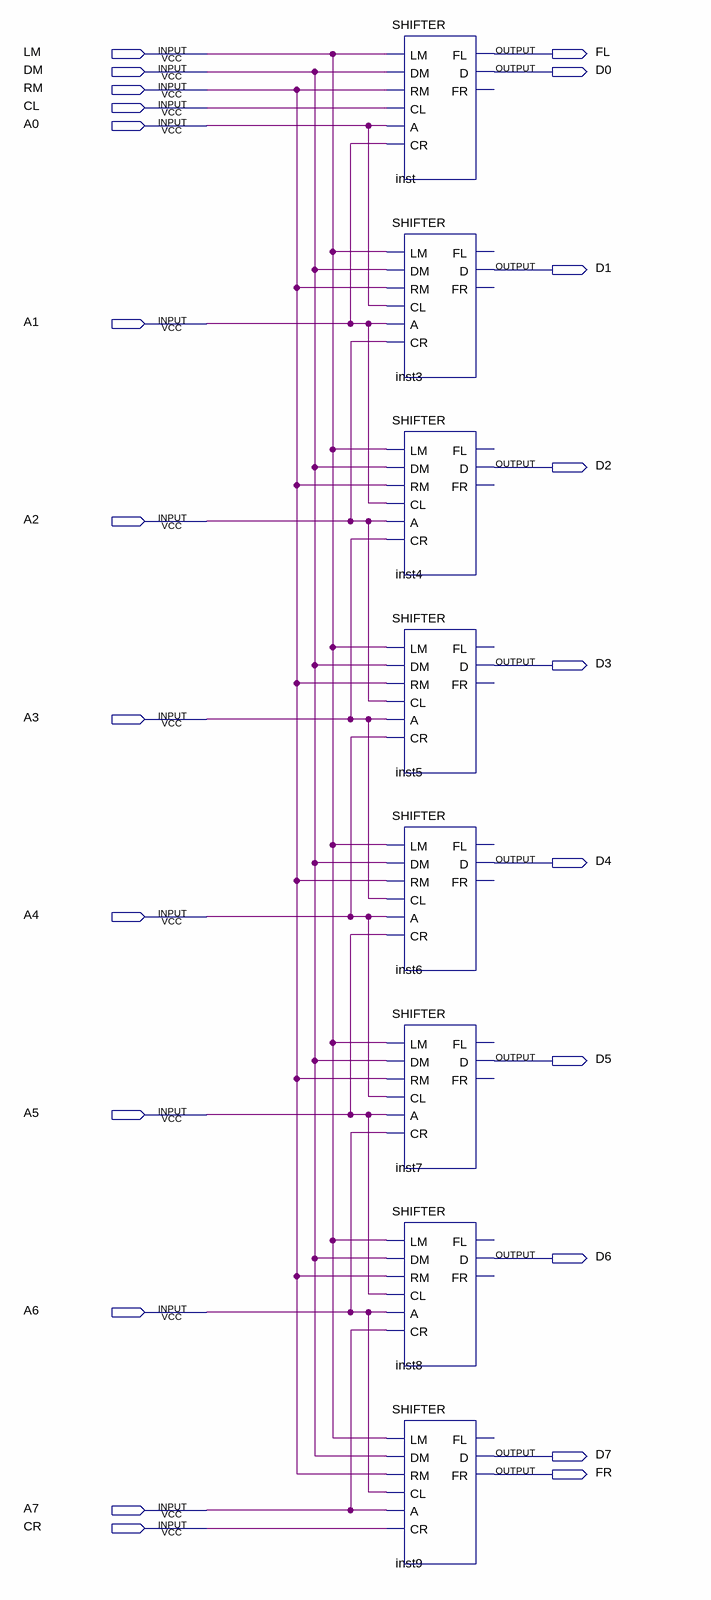
[diagram p0: schematic sheet]
// Quartus schematic SHIFTER8.bdf as structural Verilog: 8 symbols, 23 pins
module SHIFTER8 (
  input  LM,
  input  DM,
  input  RM,
  input  CL,
  input  A0,
  input  A1,
  input  A2,
  input  A3,
  input  A4,
  input  A5,
  input  A6,
  input  A7,
  input  CR,
  output FL,
  output D0,
  output D1,
  output D2,
  output D3,
  output D4,
  output D5,
  output D6,
  output D7,
  output FR
);

  SHIFTER inst (.LM(LM), .DM(DM), .RM(RM), .CL(CL), .A(A0), .CR(A1), .FL(FL), .D(D0));  // open: FR
  SHIFTER inst3 (.LM(LM), .DM(DM), .RM(RM), .CL(A0), .A(A1), .CR(A2), .D(D1));  // open: FL, FR
  SHIFTER inst4 (.LM(LM), .DM(DM), .RM(RM), .CL(A1), .A(A2), .CR(A3), .D(D2));  // open: FL, FR
  SHIFTER inst5 (.LM(LM), .DM(DM), .RM(RM), .CL(A2), .A(A3), .CR(A4), .D(D3));  // open: FL, FR
  SHIFTER inst6 (.LM(LM), .DM(DM), .RM(RM), .CL(A3), .A(A4), .CR(A5), .D(D4));  // open: FL, FR
  SHIFTER inst7 (.LM(LM), .DM(DM), .RM(RM), .CL(A4), .A(A5), .CR(A6), .D(D5));  // open: FL, FR
  SHIFTER inst8 (.LM(LM), .DM(DM), .RM(RM), .CL(A5), .A(A6), .CR(A7), .D(D6));  // open: FL, FR
  SHIFTER inst9 (.LM(LM), .DM(DM), .RM(RM), .CL(A6), .A(A7), .CR(CR), .D(D7), .FR(FR));  // open: FL
endmodule
